# Altium project NZS_A4954_R2.0.PrjPcb
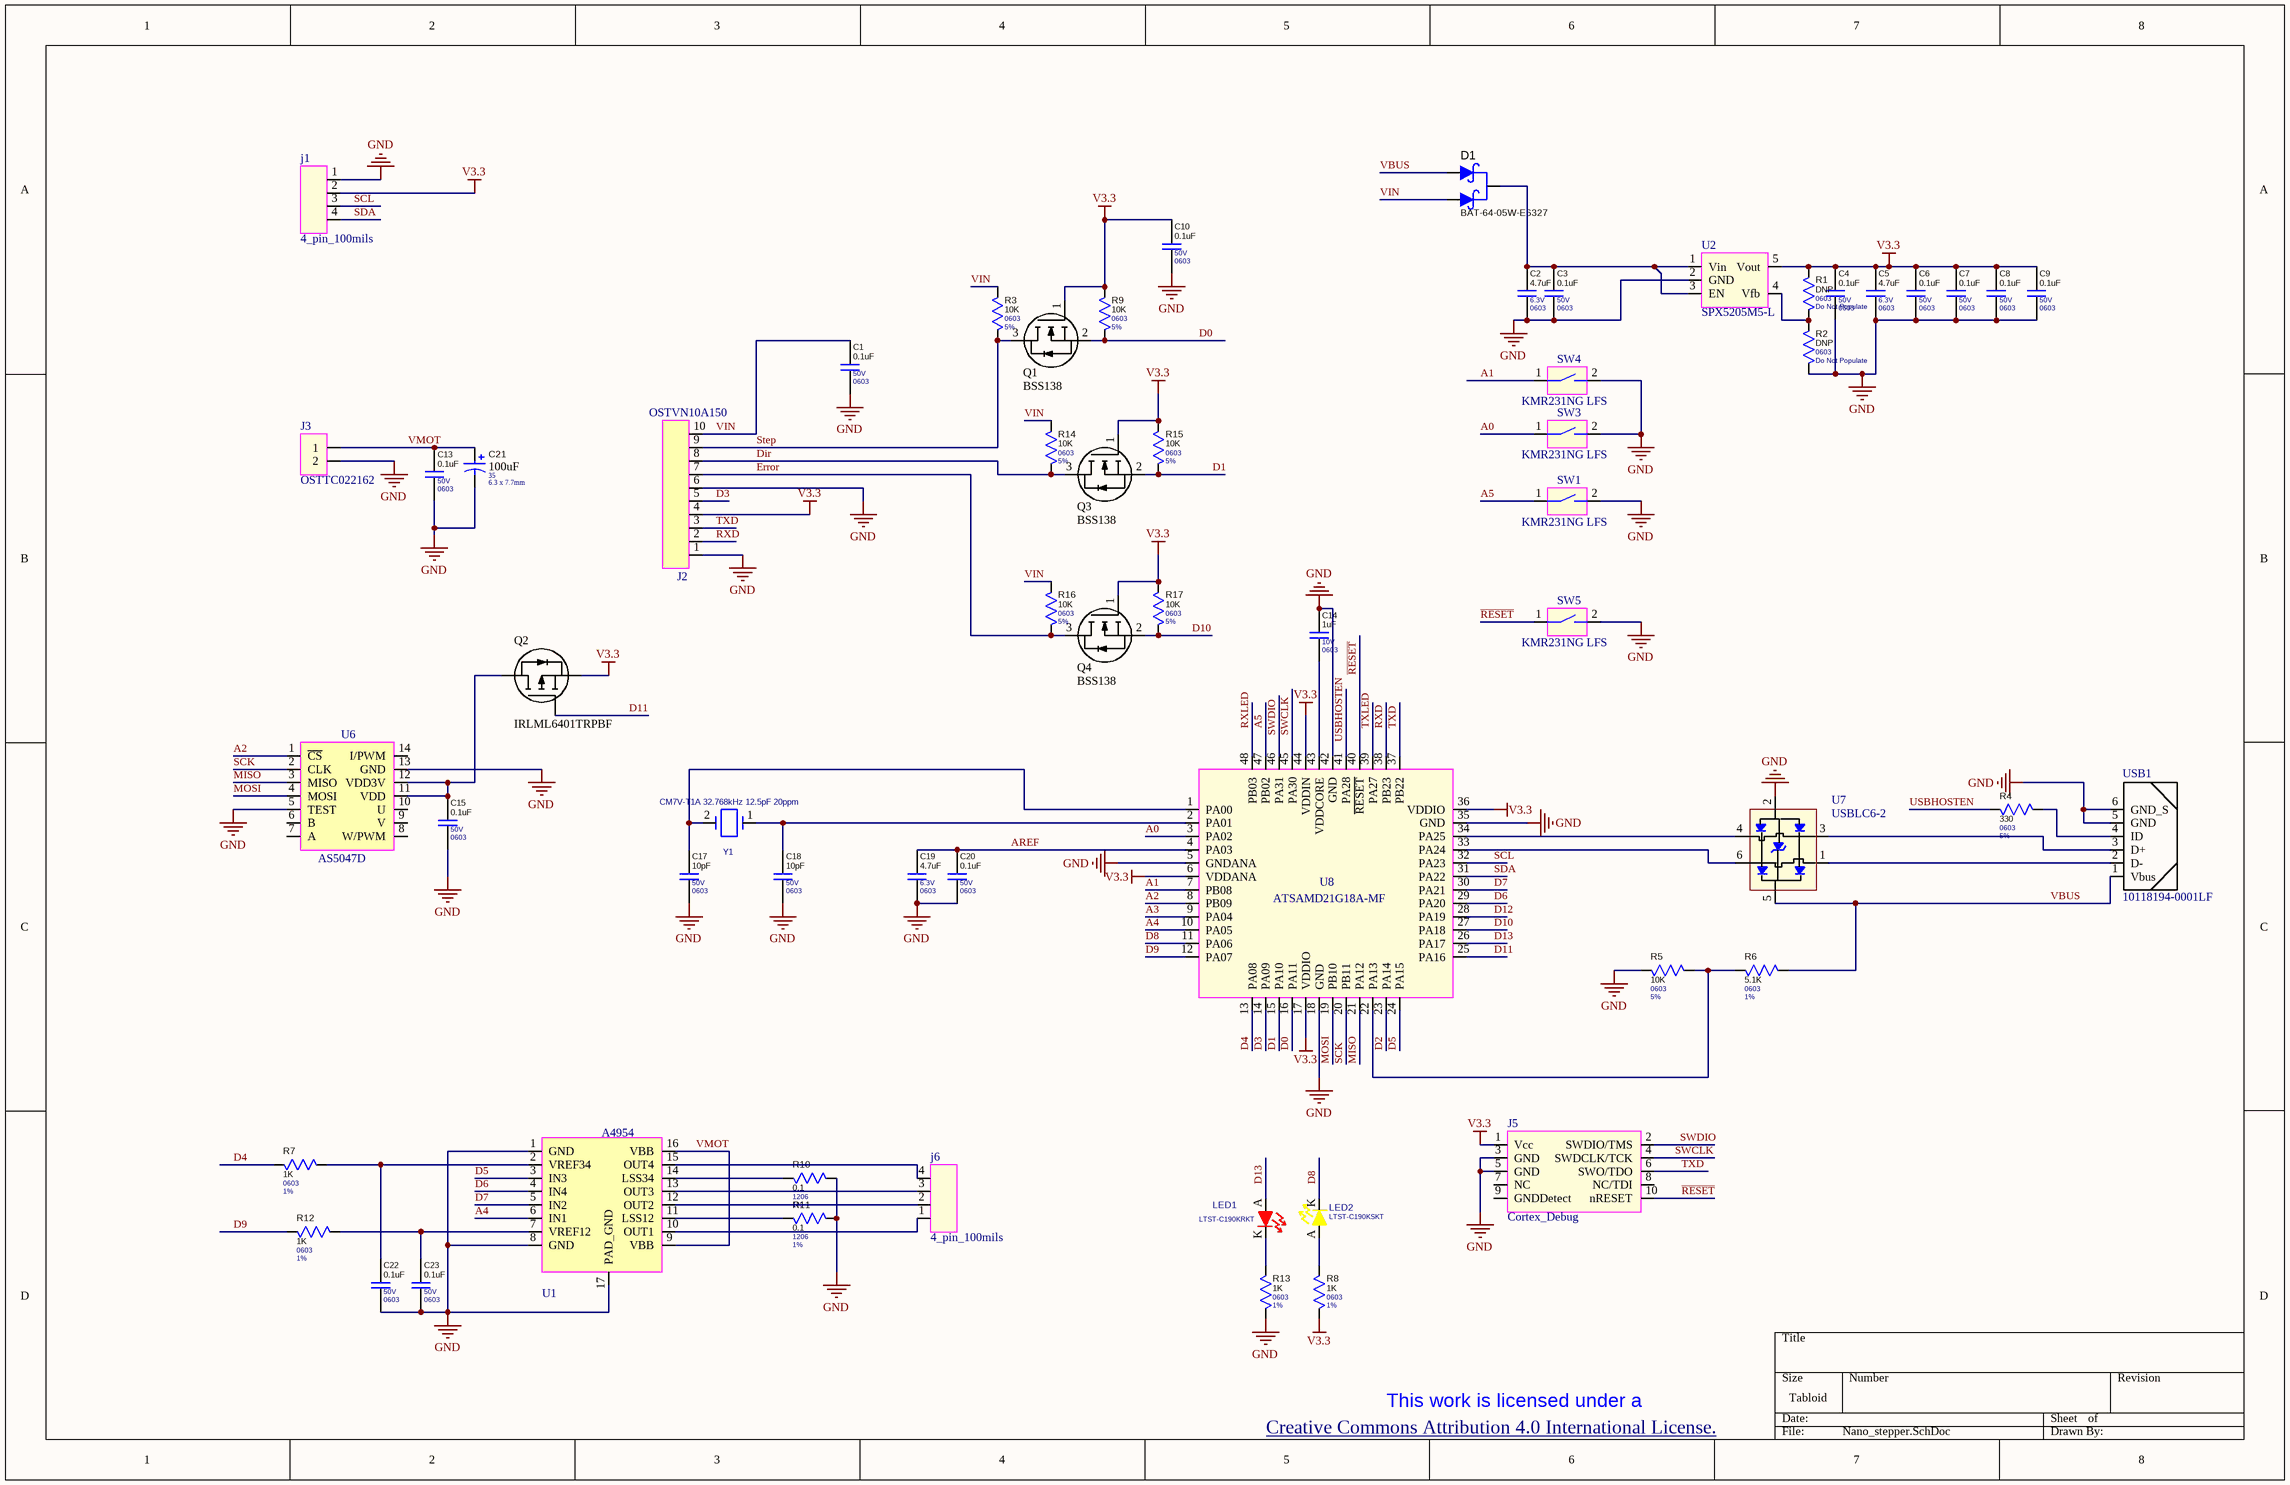
[diagram p0: Nano_stepper.SchDoc]
1 sheet, 60 parts. Net scope: global (net labels, ports and power ports of the same name join across sheets).
Board file: NZS_A4954_R2_0.PcbDoc

## Sheet Nano_stepper.SchDoc
size Tabloid; PageSetup: Record=PageOptions|CenterHorizontal=True|CenterVertical=True|PrintScale=0.98|XCorrection=1.00|YCorrection=1.00|PrintKind=0|BorderSize=5000000|LeftOffset=0|BottomOffset=0|Orientation=2|PaperLength=1000|PaperWidth=1000|Scale=100|PaperSource=7|PrintQuality=-3|MediaType=1|DitherType=10|PrintScaleMode=1|PaperKind=Tabloid|PaperIndex=3

### Parts
C1  0.1uF  Size_Imperial: 0603  Voltage_Str: 50V  [CAP_0603_H]
C2  4.7uF  Size_Imperial: 0603  Voltage_Str: 6.3V  [CAP_0603_H]
C3  0.1uF  Size_Imperial: 0603  Voltage_Str: 50V  [CAP_0603_H]
C4  0.1uF  Size_Imperial: 0603  Voltage_Str: 50V  [CAP_0603_H]
C5  4.7uF  Size_Imperial: 0603  Voltage_Str: 6.3V  [CAP_0603_H]
C6  0.1uF  Size_Imperial: 0603  Voltage_Str: 50V  [CAP_0603_H]
C7  0.1uF  Size_Imperial: 0603  Voltage_Str: 50V  [CAP_0603_H]
C8  0.1uF  Size_Imperial: 0603  Voltage_Str: 50V  [CAP_0603_H]
C9  0.1uF  Size_Imperial: 0603  Voltage_Str: 50V  [CAP_0603_H]
C10  0.1uF  Size_Imperial: 0603  Voltage_Str: 50V  [CAP_0603_H]
C13  0.1uF  Size_Imperial: 0603  Voltage_Str: 50V  [CAP_0603_H]
C14  1uF  Size_Imperial: 0603  Voltage_Str: 10V  [CAP_0603_H]
C15  0.1uF  Size_Imperial: 0603  Voltage_Str: 50V  [CAP_0603_H]
C17  10pF  Size_Imperial: 0603  Voltage_Str: 50V  [CAP_0603_H]
C18  10pF  Size_Imperial: 0603  Voltage_Str: 50V  [CAP_0603_H]
C19  4.7uF  Size_Imperial: 0603  Voltage_Str: 6.3V  [CAP_0603_H]
C20  0.1uF  Size_Imperial: 0603  Voltage_Str: 50V  [CAP_0603_H]
C21  Size: 6.3 x 7.7mm  Voltage: 35  [UWT1V101MCL1GS]  (hidden comment: 100uF)
C22  0.1uF  Size_Imperial: 0603  Voltage_Str: 50V  [CAP_0603_H]
C23  0.1uF  Size_Imperial: 0603  Voltage_Str: 50V  [CAP_0603_H]
D1  BAT-64-05W-E6327  [BAT-64-05W-E6327]
j1  4_pin_100mils  [4_pin_100mils]
J2  OSTVN10A150  [OSTVN10A150]
J3  OSTTC022162  [OSTTC022162]
J5  Cortex_Debug  [FTSH-105-01-L-D]
j6  4_pin_100mils  [4_pin_100mils]
LED1  LTST-C190KRKT  [LTST-C190KRKT]
LED2  LTST-C190KSKT  [LTST-C190KSKT]
Q1  BSS138  [BSS138]
Q2  IRLML6401TRPBF  [IRLML6401TRPBF_M]
Q3  BSS138  [BSS138]
Q4  BSS138  [BSS138]
R1  DNP  Size_Imperial: 0603  Tolerance: Do Not Populate  [RES_0603_H]
R2  DNP  Size_Imperial: 0603  Tolerance: Do Not Populate  [RES_0603_H]
R3  10K  Size_Imperial: 0603  Tolerance: 5%  [RES_0603_H]
R4  330  Size_Imperial: 0603  Tolerance: 5%  [RES_0603_H]
R5  10K  Size_Imperial: 0603  Tolerance: 5%  [RES_0603_H]
R6  5.1K  Size_Imperial: 0603  Tolerance: 1%  [RES_0603_H]
R7  1K  Size_Imperial: 0603  Tolerance: 1%  [RES_0603_H]
R8  1K  Size_Imperial: 0603  Tolerance: 1%  [RES_0603_H]
R9  10K  Size_Imperial: 0603  Tolerance: 5%  [RES_0603_H]
R10  0.1  Size_Imperial: 1206  Tolerance: 1%  [RES_1206_H]
R11  0.1  Size_Imperial: 1206  Tolerance: 1%  [RES_1206_H]
R12  1K  Size_Imperial: 0603  Tolerance: 1%  [RES_0603_H]
R13  1K  Size_Imperial: 0603  Tolerance: 1%  [RES_0603_H]
R14  10K  Size_Imperial: 0603  Tolerance: 5%  [RES_0603_H]
R15  10K  Size_Imperial: 0603  Tolerance: 5%  [RES_0603_H]
R16  10K  Size_Imperial: 0603  Tolerance: 5%  [RES_0603_H]
R17  10K  Size_Imperial: 0603  Tolerance: 5%  [RES_0603_H]
SW1  KMR231NG LFS  [KMR231NG_LFS]
SW3  KMR231NG LFS  [KMR231NG_LFS]
SW4  KMR231NG LFS  [KMR231NG_LFS]
SW5  KMR231NG LFS  [KMR231NG_LFS]
U1  A4954  [A4954]
U2  SPX5205M5-L  [SPX5205M5-L]
U6  AS5047D  [AS5047D]
U7  USBLC6-2  [USBLC6-2SC6]
U8  ATSAMD21G18A-MF  [ATSAMD21G18A-MF]
USB1  10118194-0001LF  [10118194-0001LF]
Y1  CM7V-T1A 32.768kHz 12.5pF 20ppm  [FC-135-32.7680KA-A3]

### Nets
GND: C1.2 C2.2 C3.2 C4.2 C5.2 C6.2 C7.2 C8.2 C9.2 C10.2 C13.2 C14.1 C15.2 C17.2 C18.2 C19.2 C20.2 C21.2(Neg) C22.2 C23.2 j1.1 J2.1 J2.6 J3.2 J5.3(GND) J5.5(GND) R2.1 R5.1 R10.2 R11.2 R13.2 SW1.2 SW3.2 SW4.2 SW5.2 U1.1(GND) U1.8(GND) U1.17(PAD_GND) U2.2(GND) U6.5(TEST) U6.13(GND) U7.2(GND) U8.5(GNDANA) U8.18(GND) U8.35(GND) U8.42(GND) USB1.5(GND) USB1.6(GND_S)
V3.3: C4.1 C5.1 C6.1 C7.1 C8.1 C9.1 C10.1 j1.2 J2.4 J5.1(Vcc) Q1.1 Q2.2 Q3.1 Q4.1 R1.2 R8.2 R9.2 R15.2 R17.2 U2.5(Vout) U8.6(VDDANA) U8.17(VDDIO) U8.36(VDDIO) U8.44(VDDIN)
~{RESET}: J5.10(nRESET) SW5.1 U8.40(~{RESET})
A0: SW3.1 U8.3(PA02)
A1: SW4.1 U8.7(PB08)
A2: U6.1(~{CS}) U8.8(PB09)
A3: U8.9(PA04)
A4: U1.6(IN1) U8.10(PA05)
A5: SW1.1 U8.47(PB02)
AREF: C19.1 C20.1 U8.4(PA03)
D0: Q1.2 R9.1 U8.16(PA11)
D1: Q3.2 R15.1 U8.15(PA10)
D2: U8.23(PA14)
D3: J2.5 U8.14(PA09)
D4: R7.1 U8.13(PA08)
D5: U1.3(IN3) U8.24(PA15)
D6: U1.4(IN4) U8.29(PA20)
D7: U1.5(IN2) U8.30(PA21)
D8: LED2.K U8.11(PA06)
D9: R12.1 U8.12(PA07)
D10: Q4.2 R17.1 U8.27(PA18)
D11: Q2.1 U8.25(PA16)
D12: U8.28(PA19)
D13: LED1.A U8.26(PA17)
Dir: J2.8 Q3.3 R14.1
Error: J2.7 Q4.3 R16.1
MISO: U6.3(MISO) U8.21(PA12)
MOSI: U6.4(MOSI) U8.19(PB10)
RXD: J2.2 U8.38(PB23)
RXLED: U8.48(PB03)
SCK: U6.2(CLK) U8.20(PB11)
SCL: j1.3 U8.32(PA23)
SDA: j1.4 U8.31(PA22)
Step: J2.9 Q1.3 R3.1
SWCLK: J5.4(SWDCLK/TCK) U8.45(PA30)
SWDIO: J5.2(SWDIO/TMS) U8.46(PA31)
TXD: J2.3 J5.6(SWO/TDO) U8.37(PB22)
TXLED: U8.39(PA27)
USBHOSTEN: R4.1 U8.41(PA28)
VBUS: D1.1 R6.2 U7.5(VBUS) USB1.1(Vbus)
VIN: C1.1 D1.2 J2.10 R3.2 R14.2 R16.2
VMOT: C13.1 C21.1(Pos) J3.1 U1.9(VBB) U1.16(VBB)
NetC2_1: C2.1 C3.1 D1.3 U2.1(Vin) U2.3(EN)
NetC14_2: C14.2 U8.43(VDDCORE)
NetC15_1: C15.1 Q2.3 U6.11(VDD) U6.12(VDD3V)
NetC17_1: C17.1 U8.1(PA00) Y1.2(B)
NetC18_1: C18.1 U8.2(PA01) Y1.1(A)
NetC22_1: C22.1 R7.2 U1.2(VREF34)
NetC23_1: C23.1 R12.2 U1.7(VREF12)
Netj6_1: j6.1 U1.10(OUT1)
Netj6_2: j6.2 U1.12(OUT2)
Netj6_3: j6.3 U1.13(OUT3)
Netj6_4: j6.4 U1.15(OUT4)
NetLED1_K: LED1.K R13.1
NetLED2_A: LED2.A R8.1
NetR1_1: R1.1 R2.2 U2.4(Vfb)
NetR4_2: R4.2 USB1.4(ID)
NetR5_2: R5.2 R6.1 U8.22(PA13)
NetR10_1: R10.1 U1.14(LSS34)
NetR11_1: R11.1 U1.11(LSS12)
NetU7_1: U7.1(IO1) USB1.2(D-)
NetU7_3: U7.3(IO2) USB1.3(D+)
NetU7_4: U7.4(IO2) U8.34(PA25)
NetU7_6: U7.6(IO1) U8.33(PA24)

Not connected (* = marked no-connect by the designer): J5 7(NC) 8(NC/TDI) 9(GNDDetect); U6 6(B) 7(A) 8(W/PWM) 9(V) 10(U) 14(I/PWM)

### Notes on the sheet
- Creative Commons Attribution 4.0 International License. <http://creativecommons.org/licenses/by/4.0/>
- This work is licensed under a

### Library data of the parts
C1 C3 C4 C6-C10 C13 C15 C20 C22 C23 = altiumdb529bf947b98393.42967747: CAP CER 0.1UF 50V Y5V 0603; Manufacturer: Samsung Electro-Mechanics America, Inc; Manufacture_Parts: Samsung Electro-Mechanics America, Inc:CL10F104ZB8NNNC; Vendor_Part_Number: 1276-1012-2-ND; ID: 68; Voltage: 50; Farad: 1E-7; Tolerance: -20%, +80%; Temp_Coeff: Y5V (F); Operating_Temp: -30Â°C ~ 85Â°C; Component: CL10F104ZB8NNNC; Misfit Price: 0; Vendor: Digikey; High_Price: 0.0032; Low_Price: 0.00191; Size_Metric: 1608; Watts_Str: 0W; Current_Str: A; Value: 0.1uF; Company_Part_GUID: altiumdb529bf947b98393.42967747; Size: 0603 (1608 Metric); Manufacturer_Part_Number: CL10F104ZB8NNNC; Created_Date: 12/1/2013; ComponentLink1Description: Digikey; ComponentLink2Description: Datasheet; ComponentLink1URL: http://www.digikey.com/product-detail/en/CL10F104ZB8NNNC/1276-1012-2-ND/3886670; ComponentLink2URL: http://www.samsungsem.com/servlet/FileDownload?type=spec&amp;file=CL10F104ZB8NNNC.pdf; Vendor_Part_URL: http://www.digikey.com/product-detail/en/CL10F104ZB8NNNC/1276-1012-2-ND/3886670; Vendor_Update_Date: 12/1/2013; Vendor_Qty_Avail: 0; Watts: 0; Price: 0.00191
C2 C5 C19 = altiumdb4ee8d107ce20d3.65865655: CAP 0603 CER 4.7UF 6.3V X5R 10%; Manufacturer_Part_Number: JMK107BJ475KA-T; Manufacturer: Taiyo Yuden; Misfit Part Number: 00014-001-06202; Manufacture_Parts: Panasonic - ECG:ECJ-1VB0J475K / Kemet:C0603C475K9PACTU / Taiyo Yuden:JMK107BJ475KA-T; Vendor_Part_Number: 587-1785-1-ND; ID: 52; Voltage: 6.3; Farad: 4.7E-6; Operating_Temp: -55Â°C ~ 85Â°C; Component: ECJ-1VB0J475K; Misfit Price: 0; Vendor: Digikey; Vendor_Qty_Avail: 425818; Size_Metric: 1608; Watts_Str: W; Current_Str: A; Vendor_Unit_Price: 0.27; Vendor_Packaging: Cut Tape (CT); Value: 4.7uF; Company_Part_GUID: altiumdb4ee8d107ce20d3.65865655; Size: 0603 (1608 Metric); Tolerance: 10%; Temp_Coeff: X5R; Created_Date: 12/14/2011; ComponentLink1Description: Digikey; ComponentLink2Description: Datasheet; ComponentLink1URL: http://search.digikey.com/us/en/products/JMK107BJ475KA-T/587-1785-1-ND/1212801; ComponentLink2URL: http://media.digikey.com/pdf/Data%20Sheets/Panasonic%20Capacitors%20PDFs/ECJ(HighCapacitance).pdf; Vendor_Part_URL: http://search.digikey.com/us/en/products/JMK107BJ475KA-T/587-1785-1-ND/1212801; Vendor_Update_Date: 4/26/2012; Price: 0; Vendor_Part_GUID: altiumdb4ee8d10c43eca0.93978749
C14 = altiumdb4ee8b0b72ecfe9.85374024: CAP 0603 CER 1UF 10V X5R 10%; Manufacturer: Kemet; Misfit Part Number: 00012-001-06143; Manufacture_Parts: Kemet:C0603C105K8PACTU / Panasonic - ECG:ECJ-1VB1A105K / AVX:0603ZD105KAT2A / Murata:GRM188R61A105KA61D; Vendor_Part_Number: 399-3118-1-ND; ID: 24; Voltage: 10; Farad: 1E-6; Operating_Temp: - 55 C to + 85 C; Component: C0603C105K8PACTU; Misfit Price: 0; Vendor: Digikey; Vendor_Qty_Avail: 793329; High_Price: 0.19; Low_Price: 0.005; Size_Metric: 1608; Watts_Str: W; Current_Str: A; Vendor_Unit_Price: 0.07; Value: 1uF; Company_Part_GUID: altiumdb4ee8b0b72ecfe9.85374024; Size: 0603 (1608 metric); Tolerance: 10 %; Temp_Coeff: X5R; Manufacturer_Part_Number: C0603C105K8PACTU; Created_Date: 12/14/2011; ComponentLink1Description: Mouser; ComponentLink2Description: Datasheet; ComponentLink1URL: http://search.digikey.com/us/en/products/C0603C105K8PACTU/399-3118-1-ND/551623; ComponentLink2URL: http://www.kemet.com/datasheets&C0603C105K8PACTU; Vendor_Part_URL: http://search.digikey.com/us/en/products/C0603C105K8PACTU/399-3118-1-ND/551623; Vendor_Update_Date: 4/26/2012; Price: 0.005
C17 C18 = altiumdb4ee8b063d08416.68377278: CAP 0603 CER 10PF 50V C0G 5%; Manufacturer_Part_Number: C0603C100J5GACTU; Manufacturer: Kemet; Old Part Number: 5110-0289-00; Manufacture_Parts: AVX:06035A100JAT2A / Kemet:C0603C100J5GACTU / Murata:GRM1885C1H100JA01D / Yageo:CC0603JRNPO9BN100; Vendor_Part_Number: 399-1049-1-ND; ID: 15; Voltage: 50; Farad: 1E-11; Temp_Coeff: C0G (NP0); Operating_Temp: - 55 C to + 125 C; Component: 06035A100JAT2A; Misfit Price: 0; Vendor: Digikey; Vendor_Qty_Avail: 563976; High_Price: 0.1; Low_Price: 0.014; Size_Metric: 1608; Watts_Str: W; Current_Str: A; Vendor_Unit_Price: 0.04; Value: 10pF; Company_Part_GUID: altiumdb4ee8b063d08416.68377278; Size: 0603 (1608 metric); Tolerance: 5 %; Created_Date: 12/14/2011; ComponentLink1Description: Mouser; ComponentLink2Description: Datasheet; ComponentLink1URL: http://search.digikey.com/us/en/products/C0603C100J5GACTU/399-1049-1-ND/411324; ComponentLink2URL: http://www.avx.com/docs/Catalogs/ccog.pdf; Vendor_Part_URL: http://search.digikey.com/us/en/products/C0603C100J5GACTU/399-1049-1-ND/411324; Vendor_Update_Date: 4/26/2012; Price: 0.014
C21 = altiumdb57a880e8344183.38641875: 100uF 35V SMD; Manufacture_Parts: :UWT1V101MCL1GS; ID: 15; Farad: 0; Tolerance: 20%; Vendor: unknown; Watts_Str: 0W; Current_Str: A; value: 100uF; Company_Part_GUID: altiumdb57a880e8344183.38641875; Component: UWT1V101MCL1GS; Manufacturer_Part_Number: UWT1V101MCL1GS; ComponentLink1Description: unknown; ComponentLink2Description: Datasheet; Misfit Price: 0; Size_Imperial: 6.3 x 7.7mm; Size_Metric: 6.3 x 7.7mm; Voltage_Str: 35V; Watts: 0; Price: 0
D1 = altiumdb4f1b209379f822.22085624: DIODE SCHOTTKY 40V SOT-323 250mA; Manufacturer: Infineon Technologies; Misfit Part Number: 00013-203-00104; Manufacture_Parts: Infineon Technologies:BAT 64-05W H6327 / Infineon Technologies:BAT 64-05W E6327; Vendor_Part_Number: BAT 64-05W H6327-ND; ID: 8; Component: BAT 64-05W H6327; Misfit Price: 0; Vendor: Digikey; High_Price: 0.05454; Size_Imperial: SC-70, SOT-323; Voltage_Str: 0V; Watts_Str: 0W; Current_Str: A; Vendor_Packaging: Tape & Reel (TR); Company_Part_GUID: altiumdb4f1b209379f822.22085624; Manufacturer_Part_Number: BAT 64-05W H6327; Created_Date: 2/16/2012; ComponentLink1Description: Digikey; ComponentLink2Description: Datasheet; ComponentLink1URL: http://www.digikey.com/product-detail/en/BAT%2064-05W%20E6327/BAT%2064-05W%20E6327-ND/2080553; ComponentLink2URL: http://www.infineon.com/dgdl/bat64series.pdf?folderId=db3a30431400ef68011425f1ca2505e3&amp;fileId=db3a304314dca3890115191757980ead; Vendor_Part_URL: http://search.digikey.com/scripts/DkSearch/dksus.dll?Detail&name=BAT 64-05W H6327-ND; Vendor_Update_Date: 4/26/2012; Vendor_Qty_Avail: 0; Low_Price: 0.05454; Size: SC-70, SOT-323; Size_Metric: SC-70, SOT-323; Voltage: 0; Watts: 0; Price: 0.05454
j1 j6 = altiumdb50250c9a771e29.42661008: Manufacturer: none; Manufacture_Parts: none:4_pin_100mils; ID: 26; Misfit Price: 0; Vendor: unknown; Voltage_Str: 0V; Watts_Str: 0W; Current_Str: A; Company_Part_GUID: altiumdb50250c9a771e29.42661008; Component: 4_pin_100mils; Manufacturer_Part_Number: 4_pin_100mils; ComponentLink1Description: unknown; ComponentLink2Description: Datasheet; Voltage: 0; Watts: 0; Price: 0
J2 = altiumdb567859247e8a11.17618190: CONN TERM BLOCK 2.54MM 10POS PCB; Manufacturer: On Shore Technology Inc.; Manufacture_Parts: On Shore Technology Inc.:OSTVN10A150; Vendor_Part_Number: ED10567-ND; ID: 51; Misfit Price: 0; Vendor: Digikey; High_Price: 2.45; Low_Price: 1.20764; Voltage_Str: 0V; Watts_Str: 0W; Current_Str: A; Company_Part_GUID: altiumdb567859247e8a11.17618190; Component: OSTVN10A150; Manufacturer_Part_Number: OSTVN10A150; Created_Date: 12/21/2015; ComponentLink1Description: Digikey; ComponentLink2Description: Datasheet; ComponentLink1URL: http://www.digikey.com/product-search/en?keywords=ED10567-ND; ComponentLink2URL: http://www.on-shore.com/sites/default/files/manuals/ostvnxxa150.pdf; Vendor_Part_URL: http://www.digikey.com/product-search/en?keywords=ED10567-ND; Vendor_Update_Date: 12/21/2015; Voltage: 0; Watts: 0; Price: 1.20764
J3 = altiumdb4f85748e7138c0.76964249: TERM BLOCK 5.08MM VERT 2POS PCB; Manufacturer: On Shore Technology Inc; Manufacture_Parts: On Shore Technology Inc:OSTTC022162 / On Shore Technology Inc:OSTTA024163 / On Shore Technology Inc:OSTTA024163; Vendor_Part_Number: ED2609-ND; ID: 15; Misfit Price: 0; Vendor: Digikey; Vendor_Qty_Avail: 6919; High_Price: 0.35; Low_Price: 0.1425; Voltage_Str: 0V; Watts_Str: 0W; Current_Str: A; Vendor_Packaging: Bulk; Company_Part_GUID: altiumdb4f85748e7138c0.76964249; Component: OSTTC022162; Manufacturer_Part_Number: OSTTC022162; Created_Date: 4/11/2012; ComponentLink1Description: Digikey; ComponentLink2Description: Datasheet; ComponentLink1URL: http://search.digikey.com/scripts/DkSearch/dksus.dll?vendor=0&amp;amp;keywords=OSTTC022162; ComponentLink2URL: http://www.on-shore.com/sites/default/files/manuals/osttcxx2162.pdf; Vendor_Part_URL: http://search.digikey.com/scripts/DkSearch/dksus.dll?vendor=0&keywords=OSTTC022162; Vendor_Update_Date: 4/11/2012; Voltage: 0; Watts: 0; Price: 0.1425
J5 = altiumdb4feb1a682396d4.11944837: CONN HEADER 10POS DUAL .05&quot; T/H; Manufacturer: Samtec Inc; Manufacture_Parts: Samtec Inc:FTSH-105-01-L-D; Vendor_Part_Number: FTSH-105-01-L-D-ND; ID: 24; Misfit Price: 0; Vendor: Digikey; Vendor_Qty_Avail: 269; High_Price: 1.68; Voltage_Str: 0V; Watts_Str: 0W; Current_Str: A; Vendor_Packaging: Tube; Company_Part_GUID: altiumdb4feb1a682396d4.11944837; Component: Cortex_Debug; Manufacturer_Part_Number: FTSH-105-01-L-D; Created_Date: 6/27/2012; ComponentLink1Description: Digikey; ComponentLink2Description: Datasheet; ComponentLink1URL: http://search.digikey.com/product-detail/en/FTSH-105-01-L-D/FTSH-105-01-L-D-ND/2649978; ComponentLink2URL: http://www.samtec.com/documents/webfiles/cpdf/FTSH-1XX-XX-XXX-D-XX-MKT.pdf; Vendor_Part_URL: http://search.digikey.com/product-detail/en/FTSH-105-01-L-D/FTSH-105-01-L-D-ND/2649978; Vendor_Update_Date: 6/27/2012; Low_Price: 1.68; Voltage: 0; Watts: 0; Price: 1.68
LED1 = altiumdb4f59f5b2e3b411.05953718: LED SUPER RED CLEAR 0603 SMD 20mA Vf=2V; Manufacturer: Lite-On Inc; Manufacture_Parts: Lite-On Inc:LTST-C190KRKT; Vendor_Part_Number: 160-1436-1-ND; ID: 19; Misfit Price: 0; Vendor: Digikey; Vendor_Qty_Avail: 25660; High_Price: 0.054; Low_Price: 0.033; Size_Imperial: 0603; Size_Metric: 1608; Voltage_Str: 0V; Watts_Str: 0W; Current_Str: A; Vendor_Unit_Price: 0.41; Vendor_Packaging: Cut Tape (CT); Company_Part_GUID: altiumdb4f59f5b2e3b411.05953718; Component: LTST-C190KRKT; Manufacturer_Part_Number: LTST-C190KRKT; Created_Date: 3/9/2012; ComponentLink1Description: Digikey; ComponentLink2Description: Datasheet; ComponentLink1URL: http://search.digikey.com/us/en/products/LTST-C190KRKT/160-1436-1-ND/386816; ComponentLink2URL: http://optoelectronics.liteon.com/en-us/api/DwonloadFileHandler.ashx?txtSpecNo=DS-22-99-0151&amp;txtPartNo=LTST-C190KRKT; Vendor_Part_URL: http://search.digikey.com/us/en/products/LTST-C190KRKT/160-1436-1-ND/386816; Vendor_Update_Date: 4/26/2012; Size: 0603 (1608 Metric); Voltage: 0; Watts: 0; Price: 0.033; Vendor_Part_GUID: altiumdb4f59f5957738d6.49476478
LED2 = altiumdb52dbc15523a908.74373465: LED YELLOW CLEAR 0603 SMD; Manufacturer: Lite-On Inc; Manufacture_Parts: Lite-On Inc:LTST-C190KSKT; Vendor_Part_Number: 160-1437-6-ND; ID: 27; Misfit Price: 0; Vendor: Digikey; High_Price: 0.32; Low_Price: 0.0585; Size_Imperial: 0603; Size_Metric: 1608; Voltage_Str: 0V; Watts_Str: 0W; Current_Str: A; Company_Part_GUID: altiumdb52dbc15523a908.74373465; Component: LTST-C190KSKT; Manufacturer_Part_Number: LTST-C190KSKT; Created_Date: 1/19/2014; ComponentLink1Description: Digikey; ComponentLink2Description: Datasheet; ComponentLink1URL: http://www.digikey.com/product-detail/en/LTST-C190KSKT/160-1437-6-ND/1888653; ComponentLink2URL: http://optoelectronics.liteon.com/upload/download/DS-22-99-0189/P_100_LTST-C190KSKT.pdf; Vendor_Part_URL: http://www.digikey.com/product-detail/en/LTST-C190KSKT/160-1437-6-ND/1888653; Vendor_Update_Date: 1/19/2014; Size: 0603 (1608 Metric); Voltage: 0; Watts: 0; Price: 0.0585
Q1 Q3 Q4 = altiumdb57eceeefb79952.37783215: Manufacture_Parts: :BSS138; ID: 32; Misfit Price: 0; Vendor: unknown; Voltage_Str: 0V; Watts_Str: 0W; Current_Str: A; Company_Part_GUID: altiumdb57eceeefb79952.37783215; Component: BSS138; Manufacturer_Part_Number: BSS138; ComponentLink1Description: unknown; ComponentLink2Description: Datasheet; Voltage: 0; Watts: 0; Price: 0
Q2 = altiumdb4f097f24c87689.72269489: MOSFET P-CH 12V 4.3A SOT-23; Manufacturer: International Rectifier; Misfit Part Number: 00013-209-00061; Old Part Number: 5805-0112-00; Manufacture_Parts: International Rectifier:IRLML6401TRPBF; Vendor_Part_Number: IRLML6401PBFTR-ND; ID: 2; Misfit Price: 0.0781; Vendor: Digikey; Vendor_Qty_Avail: 54000; High_Price: 0.124; Low_Price: 0.102; Size_Imperial: TO-236-3, SC-59, SOT-23-3; Voltage: 0; Voltage_Str: 0V; Watts_Str: 0W; Current_Str: A; Vendor_Unit_Price: 0.58; Vendor_Packaging: Cut Tape (CT); Company_Part_GUID: altiumdb4f097f24c87689.72269489; Component: IRLML6401TRPBF; Manufacturer_Part_Number: IRLML6401TRPBF; Created_Date: 12/14/2011; ComponentLink1Description: Datasheet; ComponentLink2Description: Digikey; ComponentLink1URL: http://www.irf.com/product-info/datasheets/data/irlml6401pbf.pdf; ComponentLink2URL: http://search.digikey.com/us/en/products/IRLML6401TRPBF/IRLML6401PBFTR-ND/811442; Vendor_Part_URL: http://search.digikey.com/us/en/products/IRLML6401TRPBF/IRLML6401PBFTR-ND/811442; Vendor_Update_Date: 1/8/2012; Size: TO-236-3, SC-59, SOT-23-3; Size_Metric: TO-236-3, SC-59, SOT-23-3; Watts: 0; Price: 0.0781; Vendor_Part_GUID: altiumdb4ee8de13578bb8.73899850
R1 R2 = resistor: Misfit Part Number: 00015-126-00006; Old Part Number: 4530-0101-00; Manufacture_Parts: Yageo:RC0603JR-070RL / Vishay/Dale:CRCW06030000Z0EA / KOA:RK73Z1JTTD / Panasonic - ECG:ERJ-3GEY0R00V / Rohm Semiconductor:MCR03EZPJ000; Vendor_Part_Number: P0.0GTR-ND; ID: 66; Working_Voltage: 0.00; Watts: 0.1; Ohms: 0; Vendor: Digikey; Vendor_Qty_Avail: 2820000; High_Price: 0.00131; Low_Price: 0.0009; Size_Metric: 1608; Voltage_Str: 0.00V; Watts_Str: 0.1W; Current_Str: A; Vendor_Unit_Price: 0.01; Vendor_Packaging: Cut Tape (CT); Value: DNP; Size: 0603 (1608 Metric); Created_Date: 12/14/2011; ComponentLink1Description: Digikey; ComponentLink2Description: Datasheet; ComponentLink1URL: http://search.digikey.com/us/en/products/ERJ-3GEY0R00V/P0.0GTR-ND/135656; ComponentLink2URL: http://www.yageo.com/documents/recent/PYu-RC0603_51_RoHS_L_4.pdf; Misfit Price: 0; Vendor_Part_URL: http://search.digikey.com/us/en/products/ERJ-3GEY0R00V/P0.0GTR-ND/135656; Vendor_Update_Date: 4/26/2012; Price: 0.0009; Vendor_Part_GUID: altiumdb4ee8dbf7950ef1.62436430
R3 R5 R9 R14-R17 = altiumdb4ee8dc331cbc98.19926137: RES 0603 TKF 10K 5% 1/10W; Manufacturer_Part_Number: RC0603JR-0710KL; Manufacturer: Yageo; Old Part Number: 4530-0107-00; Manufacture_Parts: Vishay/Dale:CRCW060310K0JNEA / Yageo:RC0603JR-0710KL; Vendor_Part_Number: 311-10KGRCT-ND; ID: 11; Working_Voltage: 31.62; Watts: 0.1; Ohms: 10000; Component: CRCW060310K0JNEA; Misfit Price: 0; Vendor: Digikey; Vendor_Qty_Avail: 2009247; High_Price: 0.004; Low_Price: 0.002; Size_Metric: 1608; Voltage_Str: 31.62V; Watts_Str: 0.1W; Current_Str: A; Vendor_Unit_Price: 0.01; Vendor_Packaging: Cut Tape (CT); Company_Part_GUID: altiumdb4ee8dc331cbc98.19926137; Value: 10K; Size: 0603 (1608 Metric); Created_Date: 12/14/2011; ComponentLink1Description: Digikey; ComponentLink2Description: Datasheet; ComponentLink1URL: http://search.digikey.com/us/en/products/RC0603JR-0710KL/311-10KGRCT-ND/729647; ComponentLink2URL: http://www.vishay.com/doc?20035; Vendor_Part_URL: http://search.digikey.com/us/en/products/RC0603JR-0710KL/311-10KGRCT-ND/729647; Vendor_Update_Date: 4/26/2012; Price: 0.002; Vendor_Part_GUID: altiumdb4ee8dc350734c7.82805431
R4 = altiumdb4ee8dc965f2f62.61392404: RES 0603 TKF 330R 5% 1/10W; Manufacturer_Part_Number: RC0603JR-07330RL; Manufacturer: Yageo; Misfit Part Number: 00015-126-33036; Manufacture_Parts: Vishay/Dale:CRCW0603330RJNEA / Yageo:RC0603JR-07330RL; Vendor_Part_Number: 311-330GRCT-ND; ID: 29; Working_Voltage: 5.74; Watts: 0.1; Component: CRCW0603330RJNEA; Misfit Price: 0; Vendor: Digikey; Vendor_Qty_Avail: 169910; High_Price: 0.004; Low_Price: 0.002; Size_Metric: 1608; Voltage_Str: 5.74V; Watts_Str: 0.1W; Current_Str: A; Vendor_Unit_Price: 0.01; Vendor_Packaging: Cut Tape (CT); Company_Part_GUID: altiumdb4ee8dc965f2f62.61392404; Value: 330; Ohms: 330; Size: 0603 (1608 Metric); Created_Date: 12/14/2011; ComponentLink1Description: Digikey; ComponentLink2Description: Datasheet; ComponentLink1URL: http://search.digikey.com/us/en/products/RC0603JR-07330RL/311-330GRCT-ND/729716; ComponentLink2URL: http://www.vishay.com/doc?20035; Vendor_Part_URL: http://search.digikey.com/us/en/products/RC0603JR-07330RL/311-330GRCT-ND/729716; Vendor_Update_Date: 4/26/2012; Price: 0.002; Vendor_Part_GUID: altiumdb4ee8dc97ccbc41.78686305
R6 = altiumdb4ee8dcacc79f57.47125618: RES 0603 TKF 5.1K 1% 1/10W; Manufacturer_Part_Number: CRCW06035K10FKEA; Manufacturer: Vishay/Dale; Misfit Part Number: 00015-124-51045; Manufacture_Parts: Yageo:RC0603FR-075K1L / Vishay/Dale:CRCW06035K10FKEA / KOA :RK73H1JTTD5101F; Vendor_Part_Number: 541-5.10KHTR-ND; ID: 35; Working_Voltage: 22.58; Watts: 0.1; Ohms: 5100; Component: RC0603FR-075K1L; Misfit Price: 0; Vendor: Digikey; Vendor_Qty_Avail: 10000; High_Price: 0.00171; Low_Price: 0.00117; Size_Metric: 1608; Voltage_Str: 22.58V; Watts_Str: 0.1W; Current_Str: A; Vendor_Unit_Price: 0.014; Vendor_Packaging: Cut Tape (CT); Company_Part_GUID: altiumdb4ee8dcacc79f57.47125618; Value: 5.1K; Size: 0603 (1608 Metric); Created_Date: 12/14/2011; ComponentLink1Description: Digikey; ComponentLink2Description: Datasheet; ComponentLink1URL: http://search.digikey.com/us/en/products/CRCW06035K10FKEA/541-5.10KHTR-ND/1174748; ComponentLink2URL: http://www.yageo.com/documents/recent/PYu-RC0603_51_RoHS_L_4.pdf; Vendor_Part_URL: http://search.digikey.com/us/en/products/CRCW06035K10FKEA/541-5.10KHTR-ND/1174748; Vendor_Update_Date: 4/26/2012; Price: 0.00117; Vendor_Part_GUID: altiumdb4ee8dcae84b624.09417177
R7 R8 R12 R13 = altiumdb4ee8dc53e1b436.35151719: RES 0603 TKF 1K 1% 1/10W; Manufacturer_Part_Number: CRCW06031K00FKEAHP; Manufacturer: Vishay/Dale; Misfit Part Number: 00015-124-10045; Manufacture_Parts: Yageo:RC0603FR-071KL / Vishay/Dale:CRCW06031K00FKEAHP / KOA :RK73H1JTTD1001F; Vendor_Part_Number: 541-1.00KSTR-ND; ID: 18; Working_Voltage: 10.00; Watts: 0.1; Ohms: 1000; Component: RC0603FR-071KL; Misfit Price: 0; Vendor: Digikey; Vendor_Qty_Avail: 5000; High_Price: 0.00171; Low_Price: 0.00117; Size_Metric: 1608; Voltage_Str: 10.00V; Watts_Str: 0.1W; Current_Str: A; Vendor_Unit_Price: 0.014; Vendor_Packaging: Cut Tape (CT); Company_Part_GUID: altiumdb4ee8dc53e1b436.35151719; Value: 1K; Size: 0603 (1608 Metric); Created_Date: 12/14/2011; ComponentLink1Description: Digikey; ComponentLink2Description: Datasheet; ComponentLink1URL: http://search.digikey.com/us/en/products/CRCW06031K00FKEAHP/541-1.00KSTR-ND/2222249; ComponentLink2URL: http://www.yageo.com/documents/recent/PYu-RC0603_51_RoHS_L_4.pdf; Vendor_Part_URL: http://search.digikey.com/us/en/products/CRCW06031K00FKEAHP/541-1.00KSTR-ND/2222249; Vendor_Update_Date: 4/26/2012; Price: 0.00117; Vendor_Part_GUID: altiumdb4ee8dc558c3e14.38282699
R10 R11 = altiumdb52db39dc769f41.69333525: RES 0.2 OHM 0.25W 1% 1206 SMD; Manufacturer: Yageo; Manufacture_Parts: Yageo:PT1206FR-070R2L; Vendor_Part_Number: 311-0.2ANDKR-ND; ID: 18; Working_Voltage: 0.22; Working_Current: 0; Watts: 0.25; Value: 0.2; Component: PT1206FR-070R2L; Vendor: Digikey; High_Price: 0.45; Low_Price: 0.07447; Size_Metric: 3216; Voltage_Str: 0.22V; Current_Str: A; Temp_Coeff: 75ppm/C; Company_Part_GUID: altiumdb52db39dc769f41.69333525; Ohms: 0.2; Size: 1206 (3216 Metric); Manufacturer_Part_Number: PT1206FR-070R2L; Created_Date: 1/18/2014; ComponentLink1Description: Digikey; ComponentLink2Description: Datasheet; ComponentLink1URL: http://www.digikey.com/product-detail/en/PT1206FR-070R2L/311-0.2ANDKR-ND/2178407; ComponentLink2URL: http://www.yageo.com/documents/recent/PYu-PT_521_RoHS_L_1.pdf; Misfit Price: 0; Vendor_Part_URL: http://www.digikey.com/product-detail/en/PT1206FR-070R2L/311-0.2ANDKR-ND/2178407; Vendor_Update_Date: 1/18/2014; Watts_Str: 0.25W; Voltage: 0; Price: 0.07447
SW1 SW3-SW5 = altiumdb5720ffb537d454.34298613: Manufacture_Parts: :KMR231NG LFS; ID: 15; Misfit Price: 0; Vendor: unknown; Voltage_Str: 0V; Watts_Str: 0W; Current_Str: A; Company_Part_GUID: altiumdb5720ffb537d454.34298613; Component: KMR231NG LFS; Manufacturer_Part_Number: KMR231NG LFS; ComponentLink1Description: unknown; ComponentLink2Description: Datasheet; Voltage: 0; Watts: 0; Price: 0
U1 = altiumdb57cf0e2bc99638.36445338: Manufacture_Parts: :A4954; ID: 39; Misfit Price: 0; Vendor: unknown; Voltage_Str: 0V; Watts_Str: 0W; Current_Str: A; Company_Part_GUID: altiumdb57cf0e2bc99638.36445338; Component: A4954; Manufacturer_Part_Number: A4954; ComponentLink1Description: unknown; ComponentLink2Description: Datasheet; Voltage: 0; Watts: 0; Price: 0
U2 = altiumdb4f9183a00484d4.75542184: IC REG LDO ADJ 150MA LN SOT23-5; Manufacturer: Exar Corporation; Misfit Part Number: 00012-001-42775; Manufacture_Parts: Exar Corporation:SPX5205M5-L; Vendor_Part_Number: 1016-1250-ND; ID: 10; Misfit Price: 0; Vendor: Digikey; Vendor_Qty_Avail: 3590; High_Price: 0.65; Low_Price: 0.2106; Size_Imperial: SC-74A, SOT-753; Voltage_Str: 0V; Watts_Str: 0W; Current_Str: A; Company_Part_GUID: altiumdb4f9183a00484d4.75542184; Component: SPX5205M5-L; Manufacturer_Part_Number: SPX5205M5-L; Created_Date: 4/20/2012; ComponentLink1Description: Digikey; ComponentLink2Description: Datasheet; ComponentLink1URL: http://search.digikey.com/us/en/products/SPX5205M5-L/1016-1250-ND/2411182; ComponentLink2URL: http://www.exar.com/Common/Content/Document.ashx?id=618; Vendor_Part_URL: http://search.digikey.com/us/en/products/SPX5205M5-L/1016-1250-ND/2411182; Vendor_Update_Date: 4/20/2012; Size: SC-74A, SOT-753; Size_Metric: SC-74A, SOT-753; Voltage: 0; Watts: 0; Price: 0.2106; Vendor_Unit_Price: 0.65
U6 = altiumdb5786b44c08eb91.84503477: Manufacture_Parts: :AS5047D; ID: 37; Misfit Price: 0; Vendor: unknown; Voltage_Str: 0V; Watts_Str: 0W; Current_Str: A; Company_Part_GUID: altiumdb5786b44c08eb91.84503477; Component: AS5047D; Manufacturer_Part_Number: AS5047D; ComponentLink1Description: unknown; ComponentLink2Description: Datasheet; Voltage: 0; Watts: 0; Price: 0
U7 = altiumdb506c612ca2ae40.60197528: TVS Diode Arrays ESD Protection Low Cap; Manufacturer: STMicroelectronics; Manufacture_Parts: STMicroelectronics:USBLC6-2SC6; Vendor_Part_Number: 511-USBLC6-2SC6; ID: 9; Misfit Price: 0; Vendor: Mouser; Vendor_Qty_Avail: 50249; High_Price: 0.67; Low_Price: 0.321; Size_Imperial: SOT-23-6; Voltage_Str: 0V; Watts_Str: 0W; Current_Str: A; Company_Part_GUID: altiumdb506c612ca2ae40.60197528; Component: USBLC6-2SC6; Manufacturer_Part_Number: USBLC6-2SC6; Created_Date: 10/3/2012; ComponentLink1Description: Mouser; ComponentLink2Description: Datasheet; ComponentLink1URL: http://www.mouser.com/Search/Refine.aspx?N=4294764375&amp;Keyword=511-USBLC6-2SC6; ComponentLink2URL: http://www.st.com/internet/com/TECHNICAL_RESOURCES/TECHNICAL_LITERATURE/DATASHEET/CD00050750.pdf; Vendor_Part_URL: http://www.mouser.com/Search/Refine.aspx?N=4294764375&Keyword=511-USBLC6-2SC6; Vendor_Update_Date: 10/3/2012; Size: SOT-23-6; Size_Metric: SOT-23-6; Voltage: 0; Watts: 0; Price: 0.321
U8 = altiumdb5720cf6a19f4d8.76560122: Company_Part_GUID: altiumdb5720cf6a19f4d8.76560122
USB1 = altiumdb561d4bc7e25b70.41497989: Connector Receptacle USB - micro B 2.0 5 Position Surface Mount, Right Angle, Horizontal; Manufacturer: FCI; Manufacture_Parts: FCI:10118194-0001LF; Vendor_Part_Number: 609-4618-6-ND; ID: 45; Misfit Price: 0; Vendor: Digikey; High_Price: 0.46; Low_Price: 0.14625; Voltage_Str: 0V; Watts_Str: 0W; Current_Str: A; Company_Part_GUID: altiumdb561d4bc7e25b70.41497989; Component: 10118194-0001LF; Manufacturer_Part_Number: 10118194-0001LF; Created_Date: 10/13/2015; ComponentLink1Description: Digikey; ComponentLink2Description: Datasheet; ComponentLink1URL: http://www.digikey.com/product-detail/en/10118194-0001LF/609-4618-6-ND/2785383; ComponentLink2URL: http://portal.fciconnect.com/Comergent//fci/drawing/10118194.pdf; Vendor_Part_URL: http://www.digikey.com/product-detail/en/10118194-0001LF/609-4618-6-ND/2785383; Vendor_Update_Date: 10/13/2015; Voltage: 0; Watts: 0; Price: 0.14625
Y1 = altiumdb5018268f58fb89.22462782: CRYSTAL 32.7680KHZ 12.5PF SMD; Manufacturer: Micro Crystal; Misfit Part Number: 00012-001-47041; Manufacture_Parts: Micro Crystal:CM7V-T1A 32.768kHz 12.5pF 20ppm / Epson Toyocom Corporation:FC-135 32.7680KA-A3 / Micro Crystal:CC7V-T1A 32.768kHz 12.5pF 20ppm; Vendor_Part_Number: SE2413TR-ND; ID: 5; Operating_Temp: -40Â°C ~ 85Â°C; Misfit Price: 0.15; Vendor: unknown; Vendor_Qty_Avail: 46500; High_Price: 1.7; Low_Price: 1.02; Size_Imperial: 2-SMD; Voltage: 0; Voltage_Str: 0V; Watts_Str: 0W; Current_Str: A; Company_Part_GUID: altiumdb5018268f58fb89.22462782; Size: 2-SMD; Component: CM7V-T1A 32.768kHz 12.5pF 20ppm; Manufacturer_Part_Number: CM7V-T1A 32.768kHz 12.5pF 20ppm; Created_Date: 12/14/2011; ComponentLink1Description: Digikey; ComponentLink2Description: Datasheet; ComponentLink1URL: http://search.digikey.com/us/en/products/FC-135%2032.7680KA-A3/SE2413TR-ND/569818; ComponentLink2URL: http://www.eea.epson.com/portal/pls/portal/docs/1/1349455.PDF; Vendor_Part_URL: http://search.digikey.com/us/en/products/FC-135%2032.7680KA-A3/SE2413TR-ND/569818; Vendor_Update_Date: 12/14/2011; Value: CM7V-T1A 32.768kHz 12.5pF 20ppm; Size_Metric: 2-SMD; Watts: 0; Price: 0.15